# EAGLE design Arduino_R3_Template (EAGLE 7.2.0)
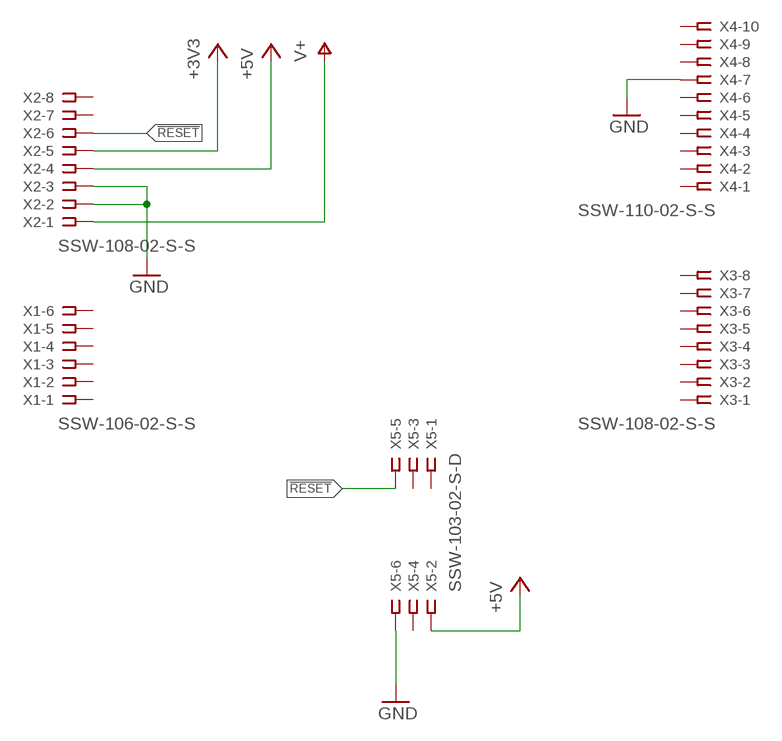
[diagram p0: schematic, sheet 1]

## Parts
X1  SSW-106-02-S-S  [SSW-106-02-S-S]
X2  SSW-108-02-S-S  [SSW-108-02-S-S]
X3  SSW-108-02-S-S  [SSW-108-02-S-S]
X4  SSW-110-02-S-S  [SSW-110-02-S-S]
X5  SSW-103-02-S-D  [SSW-103-02-S-D]

## Nets
!RESET: X2.6 X5.5
+3V3: X2.5
+5V [usbvcc]: X2.4 X5.2
GND [ground]: X2.2 X2.3 X4.7 X5.6
V+ [power]: X2.1
Unconnected: X1.1 X1.2 X1.3 X1.4 X1.5 X1.6 X2.7 X2.8 X3.1 X3.2 X3.3 X3.4 X3.5 X3.6 X3.7 X3.8 X4.1 X4.2 X4.3 X4.4 X4.5 X4.6 X4.8 X4.9 X4.10 X5.1 X5.3 X5.4

## Library data of the parts
X1 = con-samtec:SSW-106-02-S-S: THROUGH-HOLE .025" SQ POST SOCKET Source: Samtec SSW.pdf; MPN: SSW-106-02-S-S; OC_FARNELL: unknown; OC_NEWARK: 11P9416
X2 X3 = con-samtec:SSW-108-02-S-S: THROUGH-HOLE .025" SQ POST SOCKET Source: Samtec SSW.pdf; MPN: SSW-108-02-S-S; OC_FARNELL: unknown; OC_NEWARK: 11P9448
X4 = con-samtec:SSW-110-02-S-S: THROUGH-HOLE .025" SQ POST SOCKET Source: Samtec SSW.pdf; MPN: SSW-110-02-S-S; OC_FARNELL: unknown; OC_NEWARK: 11P9482
X5 = con-samtec:SSW-103-02-S-D: THROUGH-HOLE .025" SQ POST SOCKET Source: Samtec SSW.pdf; MPN: SSW-103-02-S-D; OC_FARNELL: unknown; OC_NEWARK: 11P9365

## Net classes
0 default: width 0.254 mm, clearance 0.254 mm
1 power: width 0.61 mm, drill 0.61 mm, clearance 0.254 mm
2 ground: width 0.305 mm, drill 0.559 mm, clearance 0.254 mm
3 usbvcc: width 0.508 mm, drill 0.61 mm, clearance 0.254 mm
4 aref: width 0.406 mm, drill 0.61 mm, clearance 0.254 mm

## Board
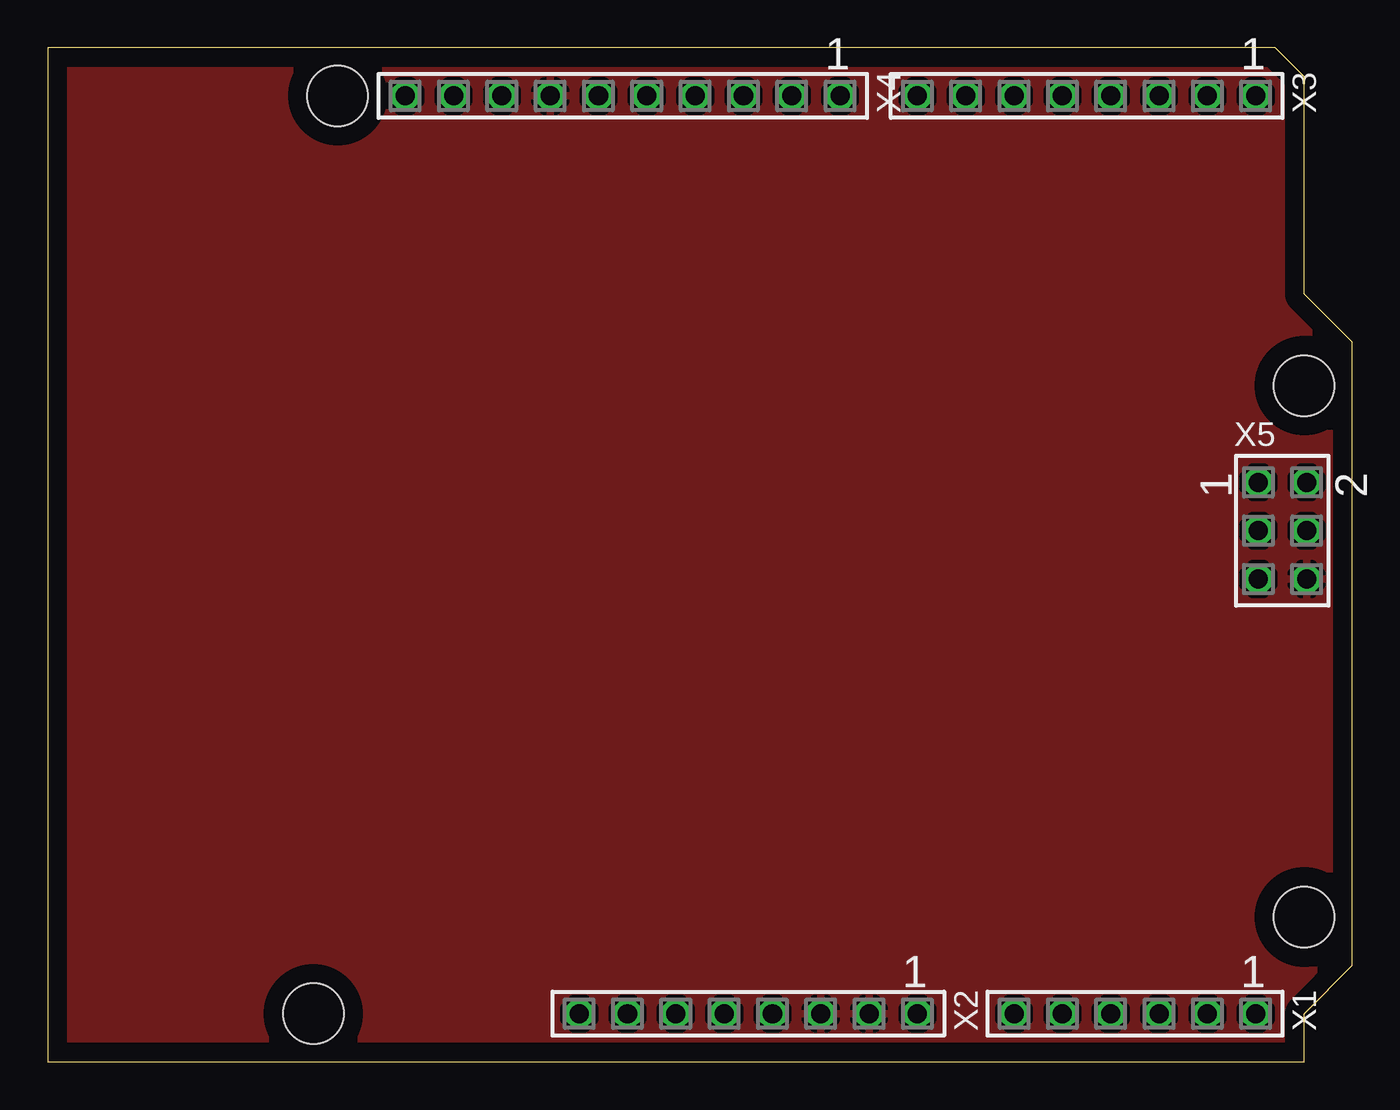
[diagram p1: board, top side]
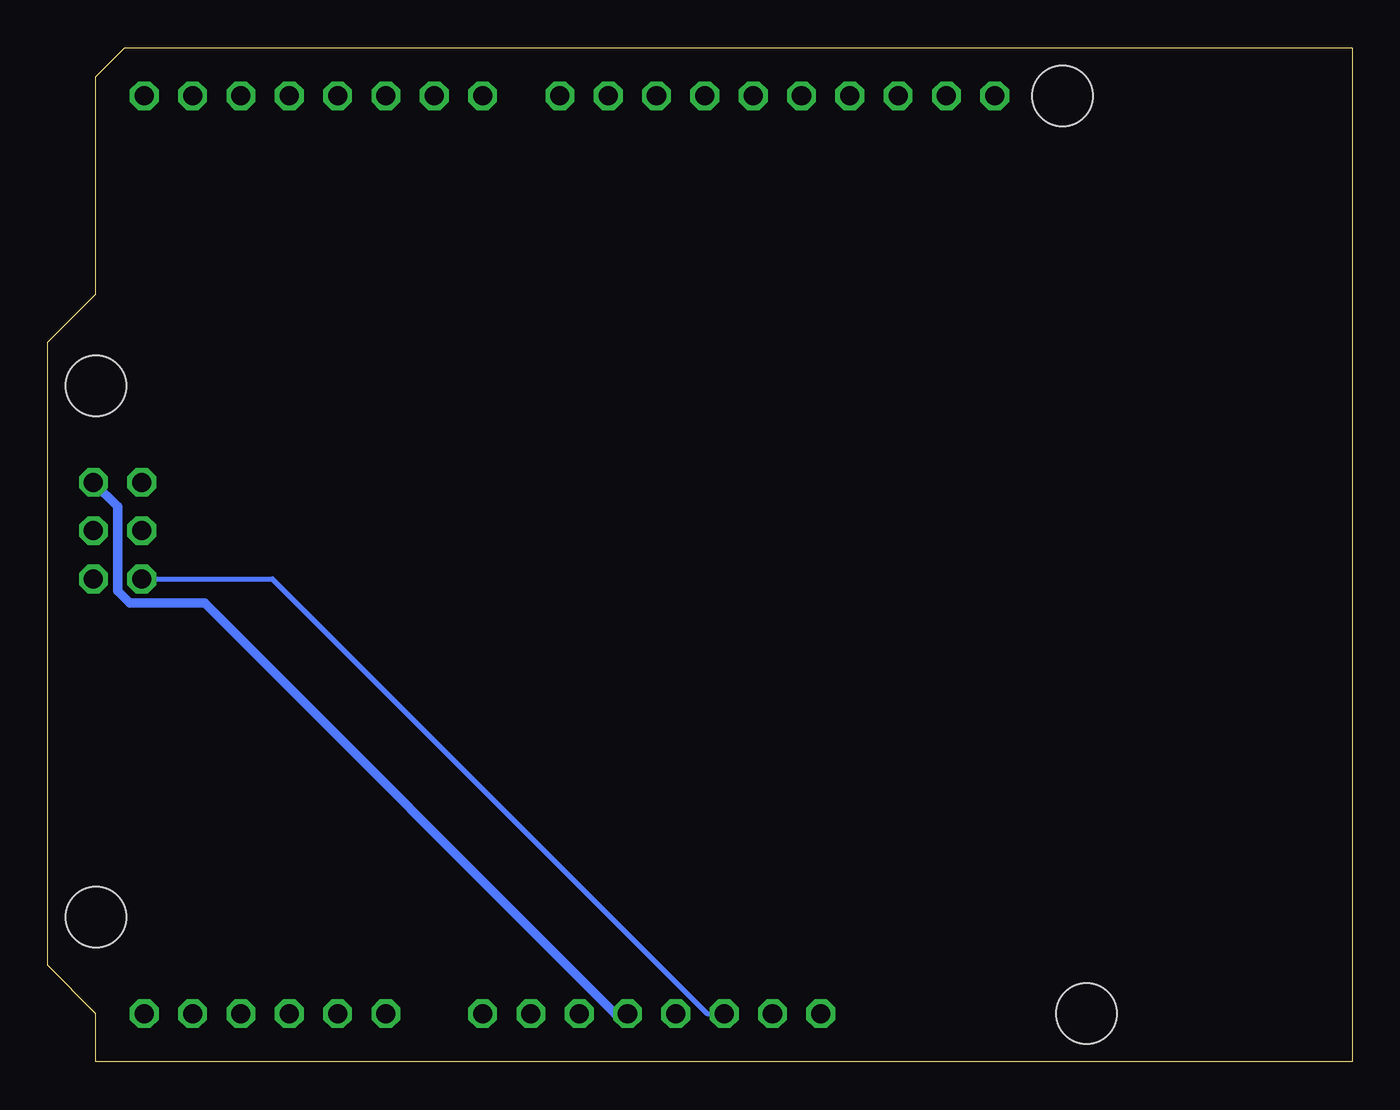
[diagram p2: board, bottom side, seen from below]

Size 68.58 x 53.34 mm. Coordinates in mm from the lower left corner, seen from the top.
Outline: 0,0 66.04,0 66.04,2.54 68.58,5.08 68.58,37.85 66.04,40.39 66.04,51.82 64.52,53.34 0,53.34 0,0
Copper layers (1*16): Top 0.035mm / dielectric 1.5mm / Bottom 0.035mm
Design rules "default": minimum track width 10mil, minimum drill 24mil, track to track 8mil, track to pad 8mil, pad to pad 8mil, via to via 8mil, smd to smd 8mil, copper to edge 40mil, drill to drill 8mil, minimum pad ring 10mil, minimum via ring 8mil, stop-mask expansion 4mil, vias tented up to drill 0mil, thermal gap 10mil
Holes 3.17 mm at 13.97,2.54 15.24,50.8 66.04,35.56 66.04,7.62

### Footprints (pad centres in the part's own frame; a part is rotated, then mirrored left to right if it is on the bottom)
SSW-106-02-S-S = drill 1 pad 1.5 octagon: 1 -6.35,0; 2 -3.81,0; 3 -1.27,0; 4 1.27,0; 5 3.81,0; 6 6.35,0
SSW-108-02-S-S = drill 1 pad 1.5 octagon: 1 -8.89,0; 2 -6.35,0; 3 -3.81,0; 4 -1.27,0; 5 1.27,0; 6 3.81,0; 7 6.35,0; 8 8.89,0
SSW-110-02-S-S = drill 1 pad 1.5 octagon: 1 -11.43,0; 2 -8.89,0; 3 -6.35,0; 4 -3.81,0; 5 -1.27,0; 6 1.27,0; 7 3.81,0; 8 6.35,0; 9 8.89,0; 10 11.43,0
SSW-103-02-S-D = drill 1 pad 1.5 octagon: 1 -2.54,-1.27; 2 -2.54,1.27; 3 0,-1.27; 4 0,1.27; 5 2.54,-1.27; 6 2.54,1.27

### Placement (x,y rotation side)
X1  57.15,2.54 180 top
X2  36.83,2.54 180 top
X3  54.61,50.8 180 top
X4  30.23,50.8 180 top
X5  64.9,27.94 270 top

### Tracks (layer width: path | path; a pad name or v marks a point on that pad's centre or on a via)
!RESET
  Bottom 0.254: X2.6 33.91,2.54 56.77,25.4 X5.5
+5V
  Bottom 0.508: X2.4 38.73,2.54 60.33,24.13 64.26,24.13 64.9,24.77 64.9,29.21 X5.2
GND
  pour Top: 0,0 66.04,0 66.04,2.54 68.58,5.08 68.58,37.85 66.04,40.39 66.04,51.82 64.52,53.34 0,53.34